# EAGLE design buckConverterRev3 (EAGLE 9.6.2)
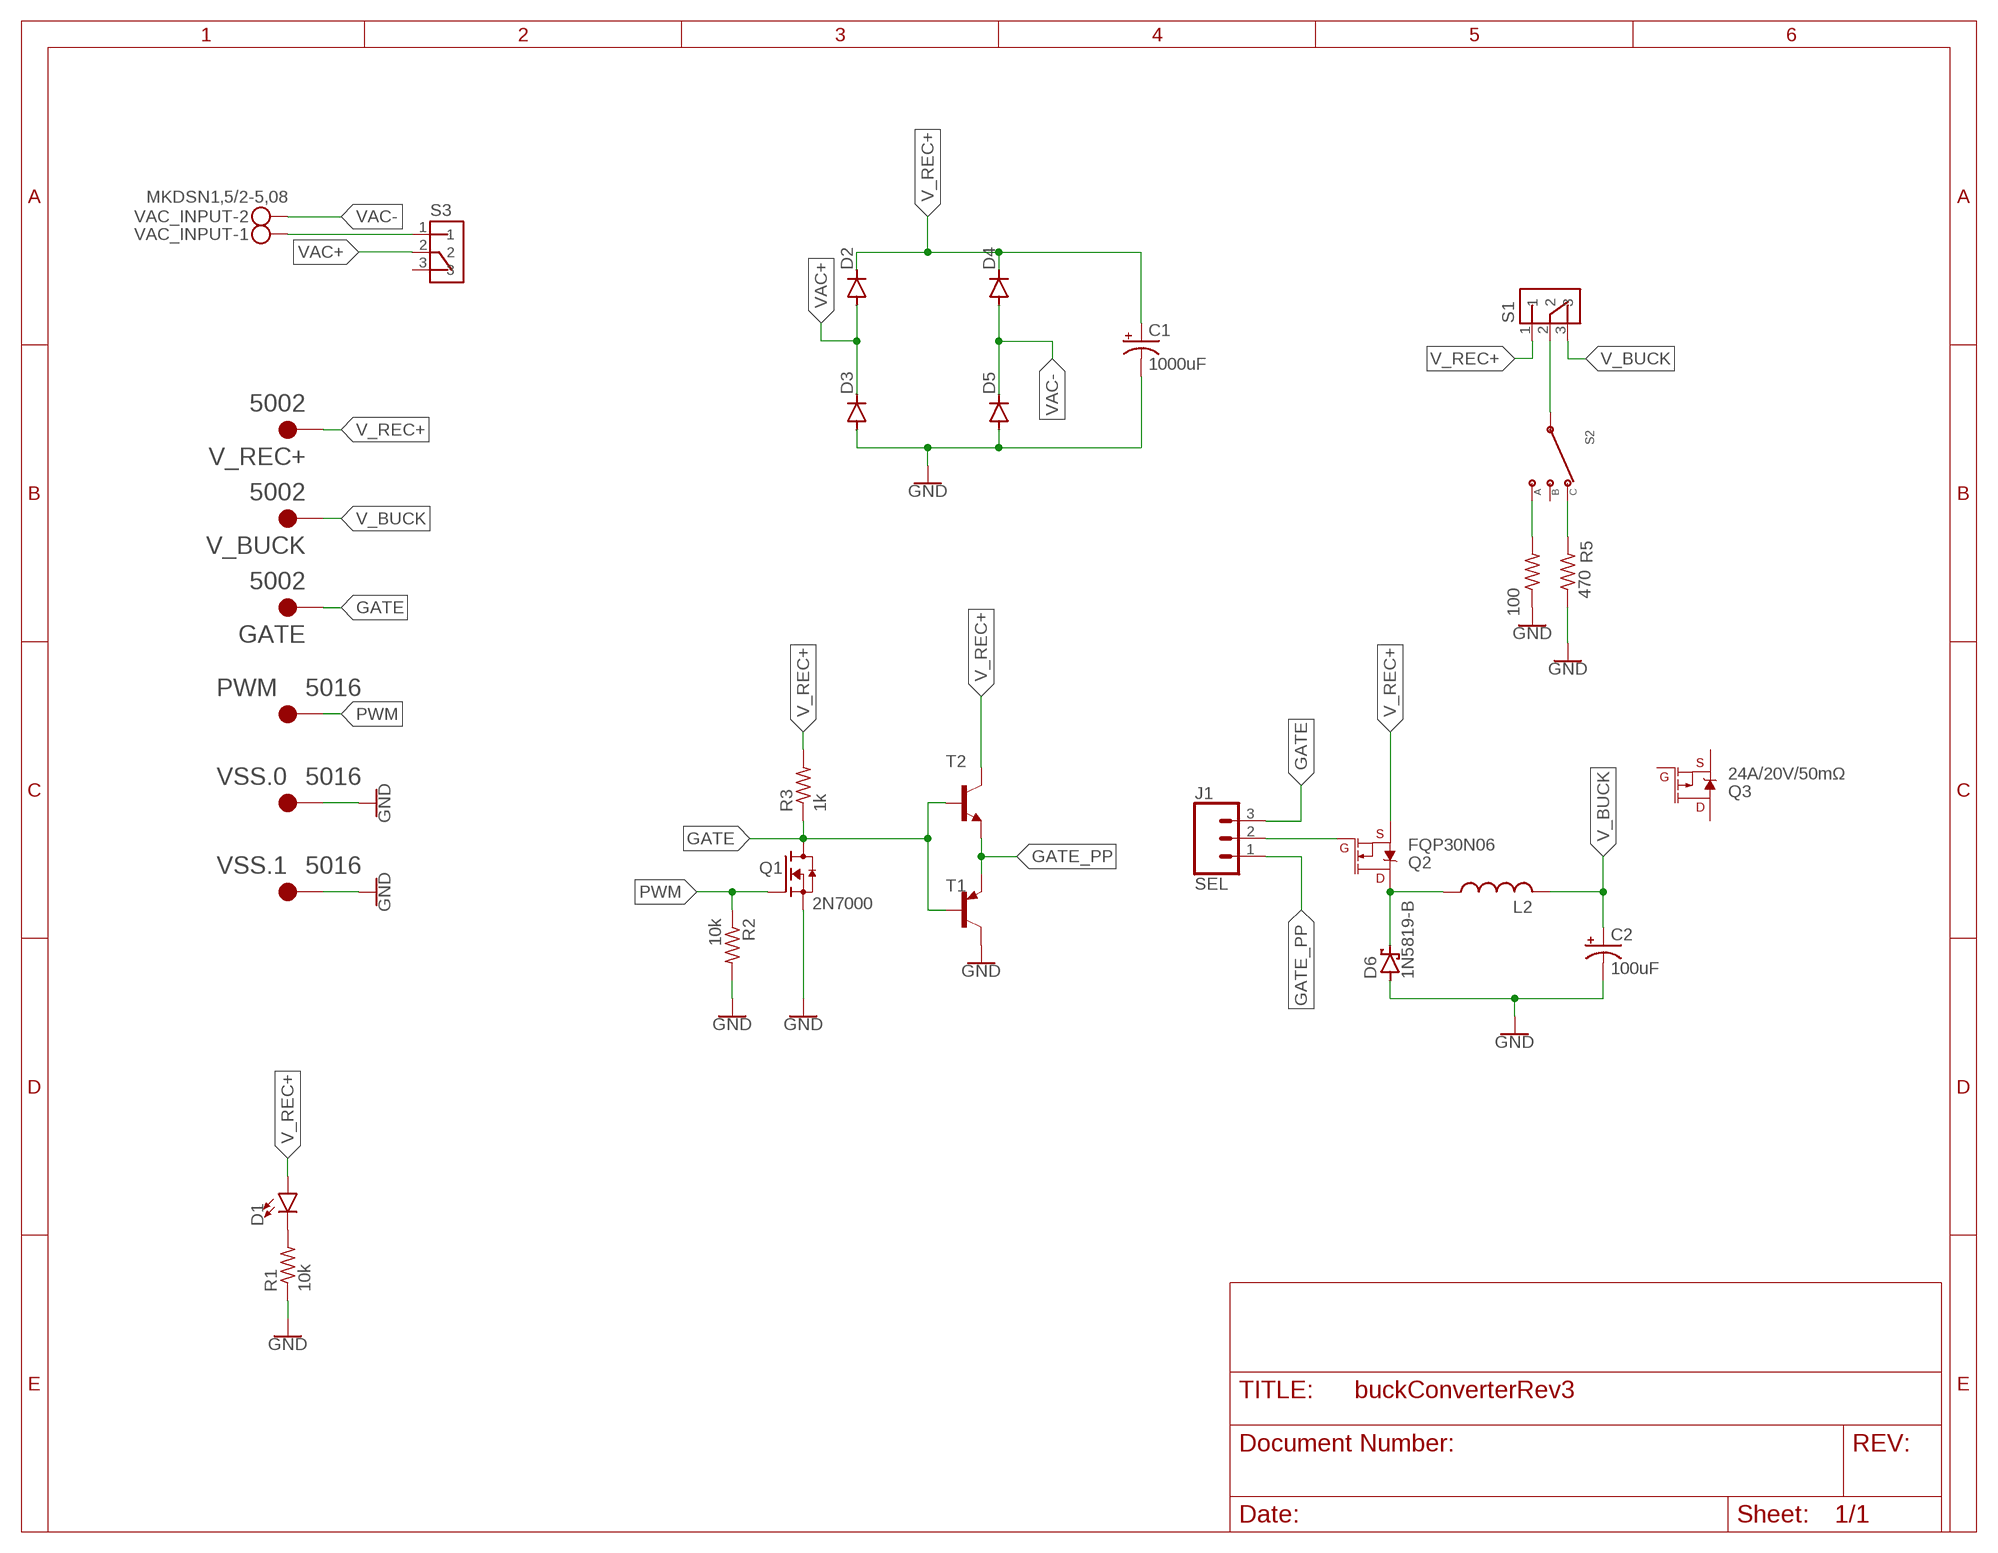
[diagram p0: schematic, sheet 1]

## Parts
C1  1000uF  CPOL-USSANYO_F13  [SANYO-OSCON_F13]
C2  100uF  CPOL-USSANYO_C  [SANYO-OSCON_C]
D1  LED5MM  [LED_5MM]
D2  DIODE-DO41-7.6  [DO41-7.6]
D3  DIODE-DO41-7.6  [DO41-7.6]
D4  DIODE-DO41-7.6  [DO41-7.6]
D5  DIODE-DO41-7.6  [DO41-7.6]
D6  1N5819-B  [DO41-7.6]
GATE  5002  [KEYSTONE_5002]
J1  SEL  CONN_03LOCK_LONGPADS  [1X03_LOCK_LONGPADS]
L2  L-US6000-XXX-RC  [6000-XXXX-RC]
PWM  5016  [KEYSTONE_5016]
Q1  2N7000  [TO92254P458H750-3]
Q2  FQP30N06  MOSFET-NCH-FQP30N06L  [TO220V]
Q3  24A/20V/50mΩ  MOSFET_PCH-NDP6020P  [TO220V]
R1  10k  R-US_0207/10  [0207/10]
R2  10k  R-US_0207/10  [0207/10]
R3  1k  R-US_0207/10  [0207/10]
R4  100  R-US_0617/22  [0617/22]
R5  470  R-US_0309/12  [0309/12]
S1  OS102011MS2QN1  [SW_OS102011MS2QN1]
S2  OS103011MS8QP1  [OS102011MS8QP1]
S3  ON/OFF  OS102011MS2QN1  [SW_OS102011MS2QN1]
T1  2N3906-PNP-TO92-EBC  [TO92-EBC]
T2  2N3904-NPN-TO92-EBC  [TO92-EBC]
V_BUCK  5002  [KEYSTONE_5002]
V_REC+  5002  [KEYSTONE_5002]
VAC_INPUT  MKDSN1,5/2-5,08  [MKDSN1,5/2-5,08]
VSS.0  5016  [KEYSTONE_5016]
VSS.1  5016  [KEYSTONE_5016]

## Nets
100OHM: R4.2 S2.1
470OHM: R5.2 S2.4
GATE: GATE.TP J1.3 Q1.3(D) R3.1 T1.B T2.B
GATE_PP: J1.1 T1.E T2.E
GND: C1.- C2.- D3.A D5.A D6.A Q1.1(S) R1.1 R2.2 R4.1 R5.1 T1.C VSS.0.TP VSS.1.TP
N$1: S3.1 VAC_INPUT.1
N$2: D1.K(C) R1.2
N$4: S1.2 S2.2(C)
N$6: J1.2 Q2.1(G)
PWM: PWM.TP Q1.2(G) R2.1
SOURCE: D6.C L2.1 Q2.2(D)
V_BUCK: C2.+ L2.2 S1.3 V_BUCK.TP
V_REC+: C1.+ D1.A D2.C D4.C Q2.3(S) R3.2 S1.1 T2.C V_REC+.TP
VAC+: D2.A D3.C S3.2
VAC-: D4.A D5.C VAC_INPUT.2
Unconnected: Q3.1(G) Q3.2(D) Q3.3(S) S2.3 S3.3

## Library data of the parts
C1 C2 = rcl:CPOL-US: POLARIZED CAPACITOR, American symbol; SPICEPREFIX: C
D1 = SparkFun-LED:LED: LED (Generic) Standard schematic elements and footprints for 5mm, 3mm, 1206, and 0603 sized LEDs. Generic LEDs with no color specified.
D2-D5 = diode:DIODE-: DIODE
D6 = diode:1N581*: 1.0A SCHOTTKY BARRIER RECTIFIER Source: http://www.diodes.com/datasheets/ds23001.pdf
GATE V_BUCK V_REC+ = 5002:5002; MANUFACTURER: Keystone; MAXIMUM_PACKAGE_HEIGHT: 4.57 mm; PARTREV: H; SNAPEDA_PN: 5000; STANDARD: Manufacturer Recommendations
J1 = SparkFun-Connectors:CONN_03: Multi connection point. Often used as Generic Header-pin footprint for 0.1 inch spaced/style header connections On any of the 0.1 inch spaced packages, you can populate with these: Break Away Headers - Straight <https://www.sparkfun.com/products/116> (PRT-00116) Break Away Male Headers - Right Angle <https://www.sparkfun.com/products/553> (PRT-00553) Female Headers <https://www.sparkfun.com/products/115> (PRT-00115) Break Away Headers - Machine Pin <https://www.sparkfun.com/products/117> (PRT-00117) Break Away Female Headers - Swiss Machine Pin <https://www.sparkfun.com/products/743> (PRT-00743) Stackable Header - 3 Pin (Female, 0.1") <https://www.sparkfun.com/products/13875> (PRT-13875) For SCREWTERMINALS and SPRING TERMINALS visit here: Screw Terimnals on SparkFun.com <https://www.sparkfun.com/search/results?term=Screw+Terminals> (5mm/3.5mm/2.54mm spacing) This device is also useful as a general connection point to wire up your design to another part of your project. Our various solder wires solder well into these plated through hole pads. Hook-Up Wire - Assortment (Stranded, 22 AWG) <https://www.sparkfun.com/products/11375> (PRT-11375) Hook-Up Wire - Assortment (Solid Core, 22 AWG) <https://www.sparkfun.com/products/11367> (PRT-11367) View the entire wire category on our website here <https://www.sparkfun.com/categories/141> Special notes: Molex polarized connector foot print use with SKU : PRT-08232 with associated crimp pins and housings.
L2 = rcl:L-US: INDUCTOR, American symbol; SPICEPREFIX: L
PWM VSS.0 VSS.1 = 5016:5016; MANUFACTURER: Keystone Electronics; MAXIMUM_PACKAGE_HEIGHT: 2.29 mm; PARTREV: D; SNAPEDA_PN: 5016; STANDARD: Manufacturer Recommendations
Q1 = 2N7000:2N7000; MANUFACTURER: Diotec Semiconductor; MAXIMUM_PACKAGE_HEIGHT: 7.5mm; PARTREV: 2024-07-16; STANDARD: IPC 7351B
Q2 = SparkFun-DiscreteSemi:MOSFET-NCH: N-channel MOSFETs Voltage controlled devices that allow control of high current outputs. SparkFun Products: SparkFun OpenScale <https://www.sparkfun.com/products/13261> SparkFun Digital Sandbox <https://www.sparkfun.com/products/12651> SparkFun Monster Moto Shield <https://www.sparkfun.com/products/10182> SparkFun MOSFET Power Controller <https://www.sparkfun.com/products/11214>; PROD_ID: TRANS-10060; VALUE: 60V/32A/35mΩ
Q3 = SparkFun-DiscreteSemi:MOSFET_PCH: P-channel MOSFETs Voltage controlled devices that allow control of high current outputs. SparkFun Products: SparkFun ESP32 Thing <https://www.sparkfun.com/products/13907> SparkFun ESP8266 Thing <https://www.sparkfun.com/products/13231> SparkFun Pi Servo HAT V2 <https://www.sparkfun.com/products/15316> DMG2305UX-7 (20V/4.2A/SOT23-3); PROD_ID: TRANS-13060
R1-R5 = rcl:R-US_: RESISTOR, American symbol; SPICEPREFIX: R
S1 S3 = OS102011MS2QN1:OS102011MS2QN1: Check availability <https://pricing.snapeda.com/parts/OS102011MS2QN1/C%26K/view-part?ref=eda>; AVAILABILITY: In Stock; CHECK_PRICES: https://www.snapeda.com/parts/OS102011MS2QN1/C%2526K/view-part/?ref=eda; DESCRIPTION: Switch,Slide,Mini,SPDT,ON-ON,Non-Shorting(BBM),100mA,12VDC,ThruHole,PC Pin | C&K OS102011MS2QN1; MF: C&K; MP: OS102011MS2QN1; PACKAGE: None; PRICE: None; SNAPEDA_LINK: https://www.snapeda.com/parts/OS102011MS2QN1/C%2526K/view-part/?ref=snap
S2 = OS103011MS8QP1:OS103011MS8QP1: Check availability <https://pricing.snapeda.com/parts/OS103011MS8QP1/C%26K/view-part?ref=eda>; AVAILABILITY: In Stock; CHECK_PRICES: https://www.snapeda.com/parts/OS103011MS8QP1/C%2526K/view-part/?ref=eda; DESCRIPTION: Switch, Slide, Mini, SP3T, ON-ON-ON, 100mA, 12VDC, ThruHole, PC Pin | C&K OS103011MS8QP1; MF: C&K; MP: OS103011MS8QP1; PACKAGE: None; PRICE: None; SNAPEDA_LINK: https://www.snapeda.com/parts/OS103011MS8QP1/C%2526K/view-part/?ref=snap
T1 = transistor-neu-to92:*-PNP-: PNP Transistror
T2 = transistor-neu-to92:*-NPN-: NPN Transistror
VAC_INPUT = con-phoenix-508:MKDSN1,5/2-5,08: MKDSN 1,5/ 2-5,08 Printklemme Nennstrom: 13,5 A Nennspannung: 250 V Rastermaß: 5,08 mm Polzahl: 2 Anschlussart: Schraubanschluss Montage: Löten Anschlussrichtung Leiter/Platine: 0 ° Artikelnummer: 1729128 Source: http://eshop.phoenixcontact.com .. 1729128.pdf

## Board
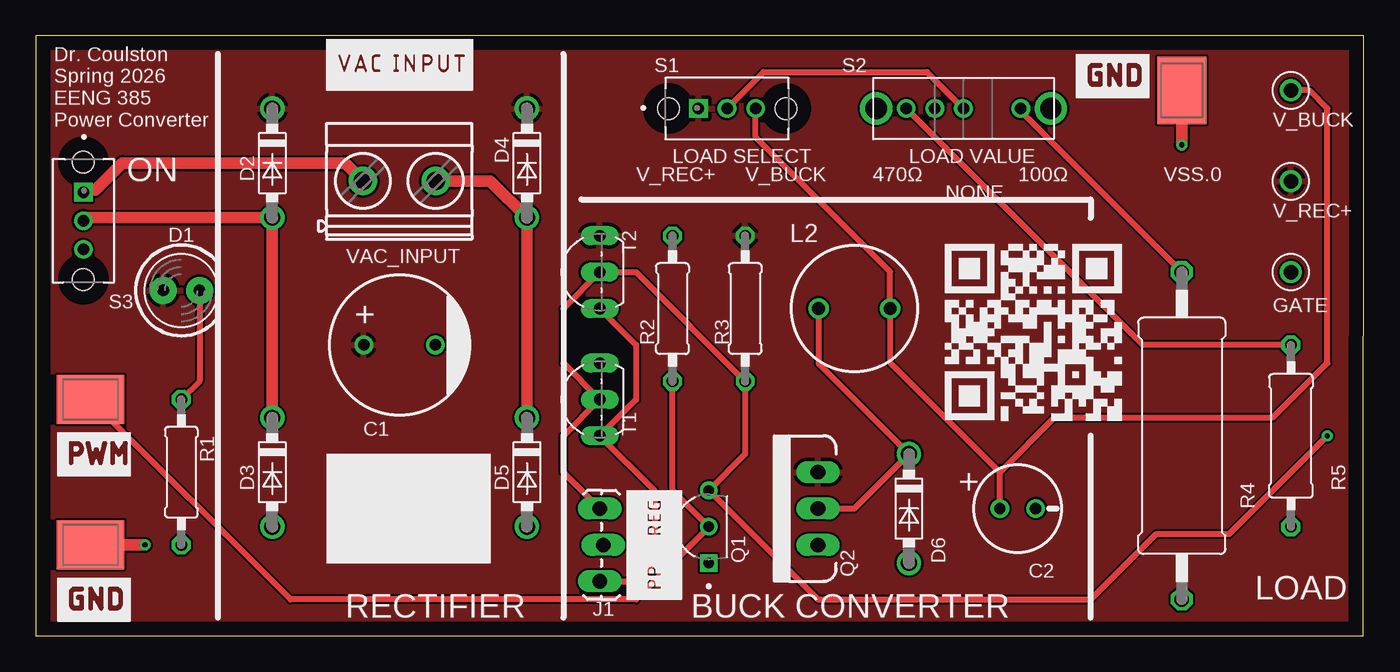
[diagram p1: board, top side]
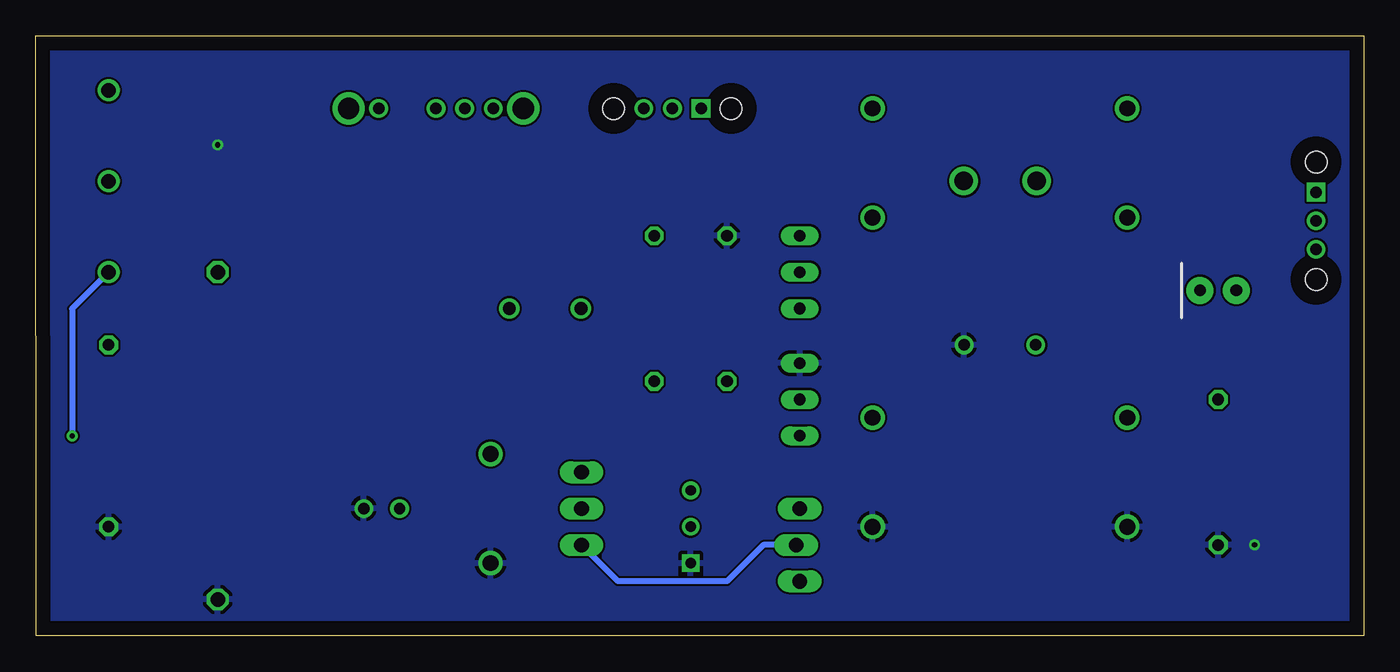
[diagram p2: board, bottom side, seen from below]

Size 92.71 x 41.91 mm. Coordinates in mm from the lower left corner, seen from the top.
Outline: 0,0 92.69,0 92.71,41.91 0,41.91 0,0
Copper layers (1*16): Top 0.035mm / dielectric 1.5mm / Bottom 0.035mm
Design rules "default": minimum track width 6mil, minimum drill 0.35mm, track to track 6mil, track to pad 6mil, pad to pad 6mil, via to via 6mil, smd to smd 6mil, copper to edge 40mil, drill to drill 6mil, minimum pad ring 10mil, minimum via ring 8mil, stop-mask expansion 4mil, vias tented up to drill 0mil, thermal gap 10mil

### Footprints (pad centres in the part's own frame; a part is rotated, then mirrored left to right if it is on the bottom)
SANYO-OSCON_F13 = drill 0.8 pad 1.27: + 2.5,0; - -2.5,0
SANYO-OSCON_C = drill 0.8 pad 1.27: + 1.25,0; - -1.25,0
LED_5MM = drill 0.813 pad 1.88: A -1.27,0; K 1.27,0
DO41-7.6 = drill 1.1 pad 1.7: A 3.81,0; C -3.81,0
KEYSTONE_5002 = drill 1.02: TP 0,0
1X03_LOCK_LONGPADS = drill 1.016 long: 1 0,0; 2 2.54,-0.254; 3 5.08,0
6000-XXXX-RC = drill 0.9 pad 1.422: 1 -2.5,0; 2 2.5,0
KEYSTONE_5016 = smd 4.7 x 3.43: TP 0,0
TO92254P458H750-3 = drill 0.72 square: 1 -2.54,0 | drill 0.72: 2 0,0; 3 2.54,0
TO220V = drill 1.016 long: 1 -2.54,0; 2 0,0; 3 2.54,0
0207/10 = drill 0.813 octagon: 1 -5.08,0; 2 5.08,0
0617/22 = drill 1.016 octagon: 1 -11.43,0; 2 11.43,0
0309/12 = drill 0.813 octagon: 1 -6.35,0; 2 6.35,0
SW_OS102011MS2QN1 = drill 0.8 square: 1 -2,0 | drill 0.8: 2 0,0; 3 2,0 | hole 1.5: -4.1,0; 4.1,0
OS102011MS8QP1 = drill 0.8: 1 -4,0; 2 0,0; 3 2,0; 4 4,0 | drill 1.5: MOUNT1 -6.1,0; MOUNT2 6.1,0
TO92-EBC = drill 0.813 long: B 0,-1.27; C 2.54,-1.27; E -2.54,-1.27
MKDSN1,5/2-5,08 = drill 1.3 pad 2: 1 -2.561,0.025; 2 2.519,0.025

### Placement (x,y rotation side)
C1  25.4,20.32 180 top
C2  68.56,8.89 180 top
D1  10.16,24.13 0 top
D2  16.51,33.02 270 top
D3  16.51,11.43 270 top
D4  34.29,33.02 270 top
D5  34.29,11.43 270 top
D6  60.96,8.89 270 top
GATE  87.63,25.4 180 top
J1  39.37,3.81 90 top
L2  57.15,22.86 0 top
PWM  3.81,16.51 0 top
Q1  46.99,7.62 90 top
Q2  54.61,8.89 90 top
Q3  55.88,-10.16 90 top  (outside the outline)
R1  10.16,11.43 90 top
R2  44.45,22.86 90 top
R3  49.53,22.86 90 top
R4  80.01,13.97 90 top
R5  87.63,13.97 90 top
S1  48.26,36.83 0 top
S2  64.77,36.83 180 top
S3  3.32,28.99 270 top
T1  38.1,16.51 90 top
T2  38.1,25.4 90 top
V_BUCK  87.63,38.1 0 top
V_REC+  87.63,31.75 0 top
VAC_INPUT  25.4,31.75 0 top
VSS.0  80.01,38.1 90 top
VSS.1  3.81,6.35 0 top

### Tracks (layer width: path | path; a pad name or v marks a point on that pad's centre or on a via)
100OHM
  Top 0.305: 68.77,36.64 S2.1
  Top 0.406: R4.2 68.77,36.64
470OHM
  Top 0.406: R5.2 77.28,20.32 S2.4
GATE  (via drill 0.35)
  Top 0.406: v90.17,13.97 83.31,7.11 78.23,7.11 73.66,2.54 54.61,2.54 Q1.3 49.53,12.7 R3.1 41.91,25.4 T2.B 36.83,22.86 36.83,19.05 T1.B 36.83,13.97 36.83,11.43 J1.3
  Bottom 0.406: GATE.TP 90.17,22.86 v90.17,13.97
GATE_PP
  Top 0.406: J1.1 41.91,3.81 43.18,5.08 43.18,10.16 T1.E 41.91,16.51 41.91,20.32 T2.E
GND  (via drill 0.35)
  Top 0.813: VSS.1.TP v7.62,6.35 | VSS.0.TP v80.01,34.29
  pour Bottom: 0,0 92.71,0 92.71,41.91 0,41.91
N$1
  Top 0.406: S3.1 3.45,31.12
  Top 0.813: 3.45,31.12 4.14,31.12 6.04,33.02 21.59,33.02 VAC_INPUT.1
N$2
  Top 0.406: D1.K 11.43,17.78 R1.2
N$4
  Top 0.406: S1.2 50.8,39.37 62.23,39.37 S2.2
N$6
  Bottom 0.406: J1.2 41.91,6.35 44.45,3.81 52.07,3.81 Q2.1
PWM
  Top 0.406: R2.1 44.45,10.16 Q1.2 41.91,2.54 17.78,2.54 PWM.TP
SOURCE
  Top 0.406: Q2.2 57.15,8.89 D6.C 54.65,19.01 L2.1
V_BUCK
  Top 0.406: S1.3 50.26,34.83 59.65,25.44 L2.2 59.65,19.09 67.31,11.43 | V_BUCK.TP 88.9,38.1 90.17,36.83 90.17,19.05 86.36,15.24 71.12,15.24 67.31,11.43 | C2.+ 67.31,11.43
V_REC+
  pour Top: 0,0 92.71,0 92.71,41.91 0,41.91
VAC+
  Top 0.813: D3.C D2.A 3.54,29.21 S3.2
VAC-
  Top 0.813: VAC_INPUT.2 31.73,31.77 D4.A D5.C

### Text on the board
tPlace: Dr. Coulston / Spring 2026 / EENG 385 / Power Converter | LOAD SELECT | LOAD VALUE | ON | V_REC+ | V_BUCK | 470Ω | 100Ω | NONE | + | + | LOAD | RECTIFIER | BUCK CONVERTER